# EAGLE design Voltage meter_Rev1 (EAGLE 6.5.0)
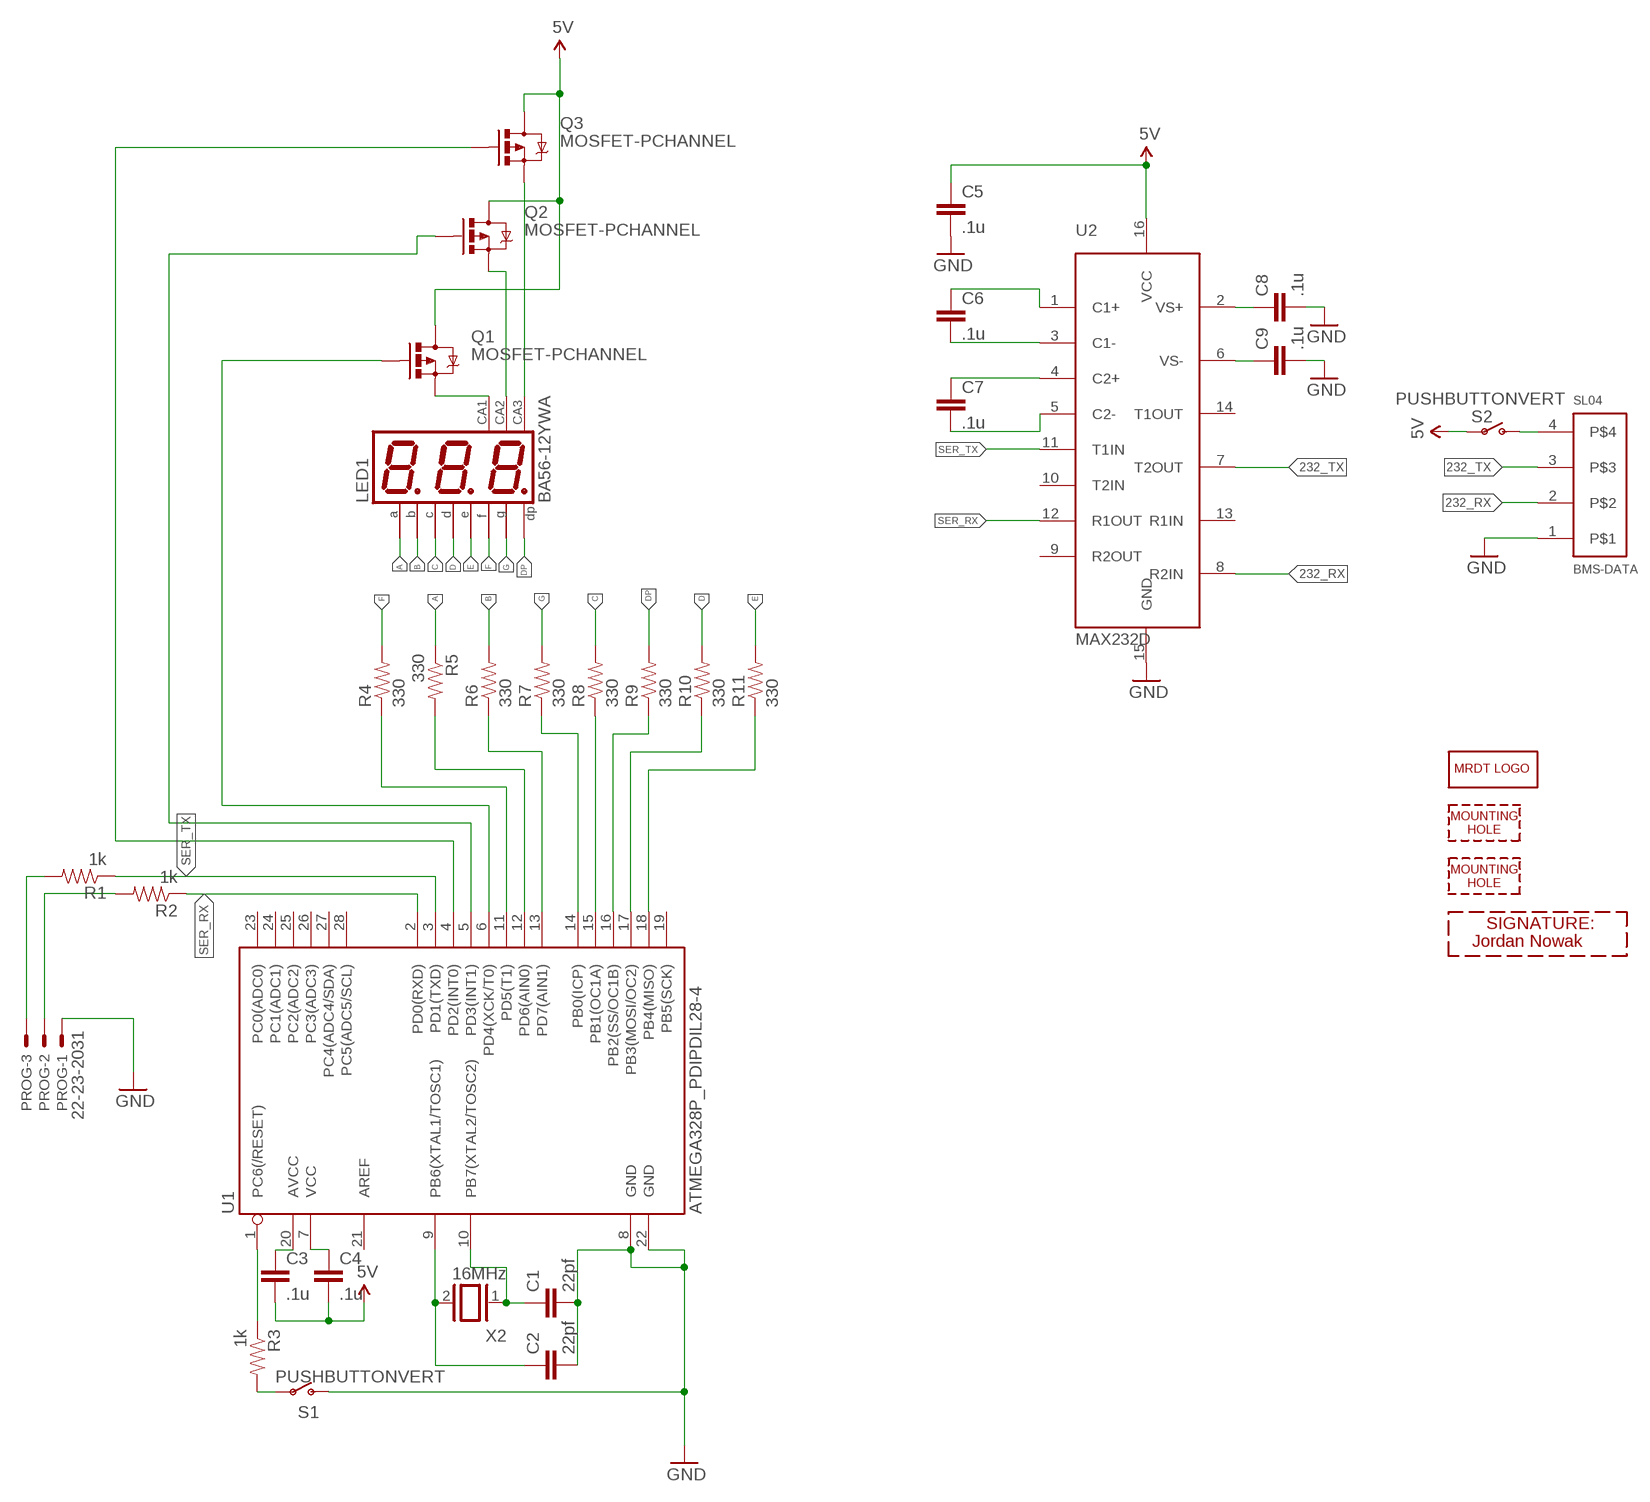
[diagram p0: schematic, sheet 1]

## Parts
BMS-DATA  SL04  [MOLEX_SL_04_TH]
C1  22pf  CAP0805  [0805]
C2  22pf  CAP0805  [0805]
C3  .1u  CAP0805  [0805]
C4  .1u  CAP0805  [0805]
C5  .1u  CAP0805  [0805]
C6  .1u  CAP0805  [0805]
C7  .1u  CAP0805  [0805]
C8  .1u  CAP0805  [0805]
C9  .1u  CAP0805  [0805]
H1  MOUNTING_HOLE#4  [#4_SCREW]
H4  MOUNTING_HOLE#4  [#4_SCREW]
LED1  BA56-12YWA  [BX56-12]
LOGO1  MRDT_LOGO  [MRDT_LOGO]
PROG  22-23-2031  [22-23-2031]
Q1  MOSFET-PCHANNEL  [SOT23-3]
Q2  MOSFET-PCHANNEL  [SOT23-3]
Q3  MOSFET-PCHANNEL  [SOT23-3]
R1  1k  RESISTOR0805-RES  [0805]
R2  1k  RESISTOR0805-RES  [0805]
R3  1k  RESISTOR0805-RES  [0805]
R4  330  RESISTOR0805-RES  [0805]
R5  330  RESISTOR0805-RES  [0805]
R6  330  RESISTOR0805-RES  [0805]
R7  330  RESISTOR0805-RES  [0805]
R8  330  RESISTOR0805-RES  [0805]
R9  330  RESISTOR0805-RES  [0805]
R10  330  RESISTOR0805-RES  [0805]
R11  330  RESISTOR0805-RES  [0805]
S1  PUSHBUTTONVERT  [APEM-MJTP1243]
S2  PUSHBUTTONVERT  [APEM-MJTP1243]
U1  ATMEGA328P_PDIPDIL28-4  [CONN_IC_DIP_SOCKET_28POS]
U2  MAX232D  [SOIC16]
U$1  JORDAN-NOWAK  [JORDAN-NOWAK-SIG]
X2  16MHz  XTAL/S  [QS]

## Nets
5V: C3.2 C4.2 C5.1 Q1.3(D) Q2.3(D) Q3.3(D) S2.P$1(P) U2.16(VCC)
232_RX: BMS-DATA.2 U2.8(R2IN)
232_TX: BMS-DATA.3 U2.7(T2OUT)
A: LED1.11(A) R5.1
B: LED1.7(B) R6.2
C: LED1.4(C) R8.2
D: LED1.2(D) R10.2
DP: LED1.3(DP) R9.2
E: LED1.1(E) R11.2
F: LED1.10(F) R4.2
G: LED1.5(G) R7.2
GND: BMS-DATA.1 C1.2 C2.2 C5.2 C8.2 C9.2 PROG.1 S1.P$2(S) U1.8(GND) U1.22(GND) U2.15(GND)
N$1: R7.1 U1.14(PB0(ICP))
N$2: LED1.12(CA) Q1.2(S)
N$3: LED1.9(CA) Q2.2(S)
N$4: LED1.8(CA) Q3.2(S)
N$5: R8.1 U1.15(PB1(OC1A))
N$6: R9.1 U1.16(PB2(SS/OC1B))
N$7: BMS-DATA.4 S2.P$2(S)
N$8: R5.2 U1.12(PD6(AIN0))
N$9: R10.1 U1.17(PB3(MOSI/OC2))
N$10: R11.1 U1.18(PB4(MISO))
N$11: C8.1 U2.2(VS+)
N$12: PROG.2 R2.2
N$13: R3.2 S1.P$1(P)
N$14: PROG.3 R1.2
N$15: C4.1 U1.7(VCC)
N$16: C3.1 U1.20(AVCC)
N$18: R6.1 U1.13(PD7(AIN1))
N$20: R4.1 U1.11(PD5(T1))
N$24: R3.1 U1.1(PC6(/RESET))
N$40: C6.1 U2.1(C1+)
N$42: C6.2 U2.3(C1-)
N$43: C7.1 U2.4(C2+)
N$44: C7.2 U2.5(C2-)
N$45: C9.1 U2.6(VS-)
N$50: C2.1 U1.9(PB6(XTAL1/TOSC1)) X2.2
N$51: C1.1 U1.10(PB7(XTAL2/TOSC2)) X2.1
Q4: Q3.1(G) U1.4(PD2(INT0))
Q5: Q2.1(G) U1.5(PD3(INT1))
Q6: Q1.1(G) U1.6(PD4(XCK/T0))
SER_RX: R2.1 U1.2(PD0(RXD)) U2.12(R1OUT)
SER_TX: R1.1 U1.3(PD1(TXD)) U2.11(T1IN)
Unconnected: U1.19(PB5(SCK)) U1.21(AREF) U1.23(PC0(ADC0)) U1.24(PC1(ADC1)) U1.25(PC2(ADC2)) U1.26(PC3(ADC3)) U1.27(PC4(ADC4/SDA)) U1.28(PC5(ADC5/SCL)) U2.9(R2OUT) U2.10(T2IN) U2.13(R1IN) U2.14(T1OUT)

## Library data of the parts
BMS-DATA = MRDT-Connectors:SL04
C1-C9 = SparkFun-Passives:CAP: Capacitor Standard 0603 ceramic capacitor, and 0.1" leaded capacitor.
H1 H4 = MRDT-Hardware:MOUNTING_HOLE: Mounting hole for M6 bolt. Standard use mounting hole for: Tiva C Connected - M6 Anderson Powerpole Mounting Wing - M8 Most frame-mounted PCB's - M8
LED1 = display-kingbright:B?56-12*WA: 14.22mm (0.56INCH) THREE DIGIT NUMERIC DISPLAY Source: http://www.kingbright.com .. BA56-11EWA(Ver1189474895.pdf; OC_FARNELL: unknown; OC_NEWARK: unknown
LOGO1 = MRDT-Hardware:MRDT_LOGO
PROG = con-molex:22-23-2031: .100" (2.54mm) Center Header - 3 Pin; MF: MOLEX; MPN: 22-23-2031; OC_FARNELL: 1462950; OC_NEWARK: 30C0862
Q1-Q3 = SparkFun-DiscreteSemi:MOSFET-PCHANNEL: Generic PMOSFET IRLML2244 - TRANS-11153 (SOT-23 -20V -4.3A) (1.Gate 2.Source 3.Drain) FQP27P06 - COM-10349 <http://www.sparkfun.com/products/10349> (TO-220 -60V -27A) (1.Gate 2.Source 3.Drain); PROD_ID: TRANS-08285
R1-R11 = SparkFun-Passives:RESISTOR: Resistor Basic schematic elements and footprints for 0603, 1206, and PTH resistors.
S1 S2 = MRDT-UserInput:PUSHBUTTON; PARTNO: MJTP1243
U1 = SparkFun-DigitalIC:ATMEGA328P_PDIP: uC used in the Arduino 32kb flash, 1k EEPROM, 2k SRAM This is the through-hole version of this chip.
U2 = MRDT-ICs:MAX*232; OPERATING_VOLTAGE: 5V
U$1 = sig:JORDAN-NOWAK
X2 = special:XTAL/S: CRYSTAL

## Board
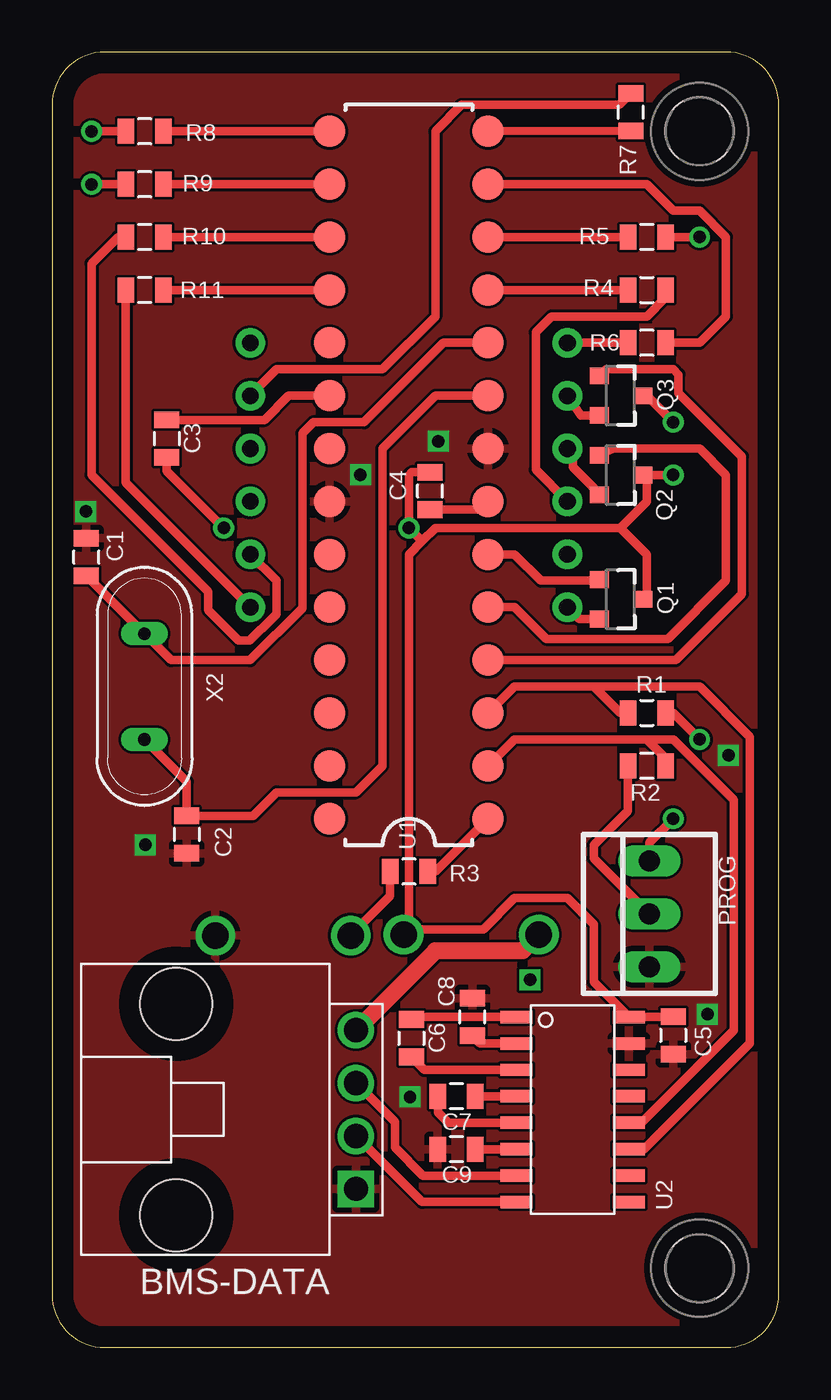
[diagram p1: board, top side]
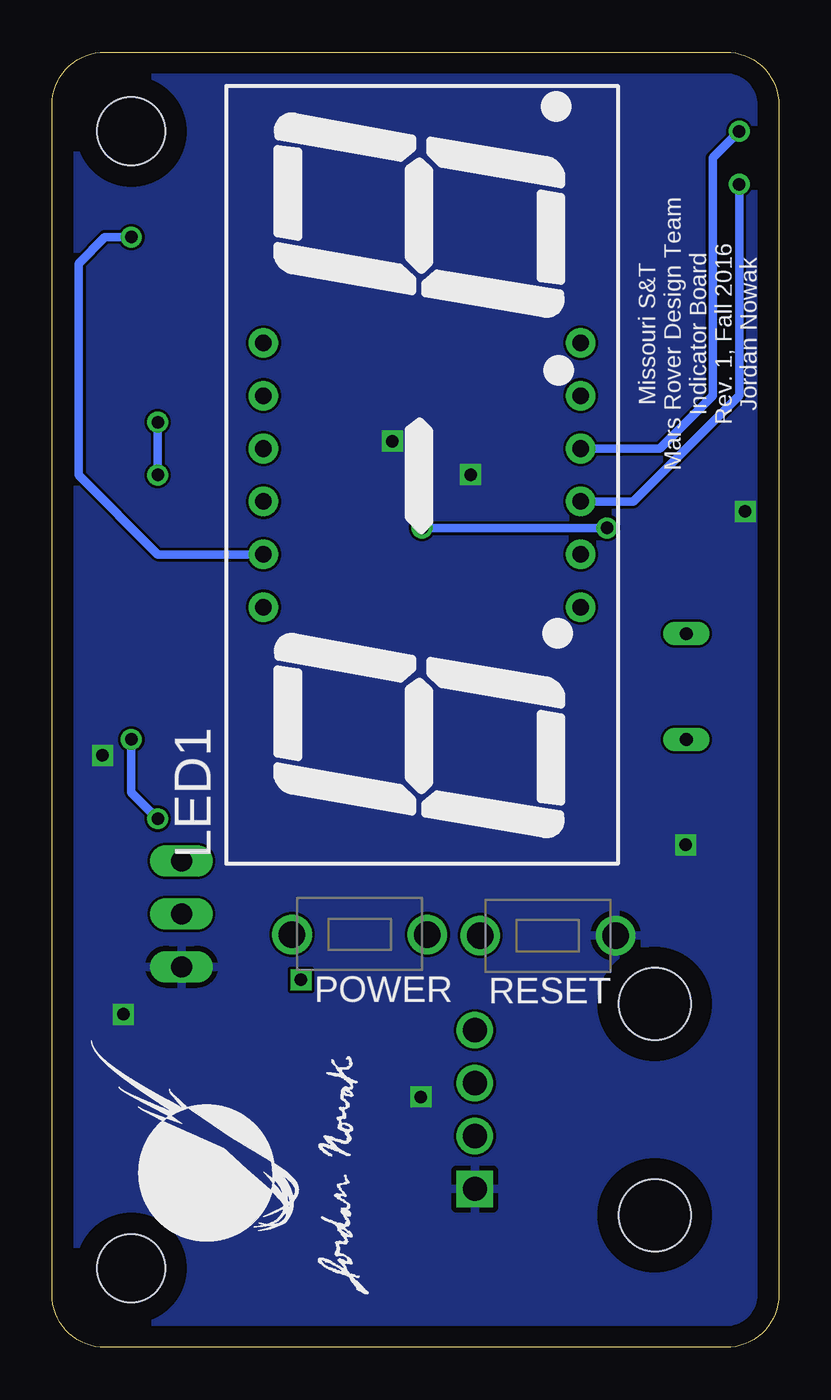
[diagram p2: board, bottom side, seen from below]

Size 34.92 x 62.23 mm. Coordinates in mm from the lower left corner, seen from the top.
Outline: 32.38,62.23 2.54,62.23 arc90 0,59.69 0,2.54 arc90 2.54,0 32.38,0 arc90 34.92,2.54 34.92,59.69 arc90 32.38,62.23
Copper layers (1*16): Top 0.035mm / dielectric 1.5mm / Bottom 0.035mm
Design rules "advanced_circuits_standard": minimum track width 5mil, minimum drill 10mil, track to track 5mil, track to pad 5mil, pad to pad 5mil, via to via 5mil, smd to smd 5mil, copper to edge 40mil, drill to drill 5mil, minimum pad ring 10mil, minimum via ring 8mil, stop-mask expansion 4mil, vias tented up to drill 0mil, thermal gap 10mil

### Footprints (pad centres in the part's own frame; a part is rotated, then mirrored left to right if it is on the bottom)
MOLEX_SL_04_TH = drill 1.168 square: 1 -3.81,0 | drill 1.168: 2 -1.27,0; 3 1.27,0; 4 3.81,0 | hole 3.454: -5.08,8.636; 5.08,8.636
0805 = smd 0.8 x 1.2: 1 -0.9,0; 2 0.9,0
#4_SCREW = hole 3.264: 0,0
BX56-12 = drill 0.8 pad 1.422: 1 -6.35,-7.62; 2 -3.81,-7.62; 3 -1.27,-7.62; 4 1.27,-7.62; 5 3.81,-7.62; 6 6.35,-7.62; 7 6.35,7.62; 8 3.81,7.62; 9 1.27,7.62; 10 -1.27,7.62; 11 -3.81,7.62; 12 -6.35,7.62
22-23-2031 = drill 1 long: 1 -2.54,0; 2 0,0; 3 2.54,0
SOT23-3 = smd 0.8 x 0.9: 1 -0.95,-1; 2 0.95,-1; 3 0,1.1
APEM-MJTP1243 = drill 1.27: P$1 -0.254,1.753; P$2 6.248,1.753
CONN_IC_DIP_SOCKET_28POS = smd 1.524 x 1.524: 1 -17.78,-3.81; 2 -15.24,-3.81; 3 -12.7,-3.81; 4 -10.16,-3.81; 5 -7.62,-3.81; 6 -5.08,-3.81; 7 -2.54,-3.81; 8 0,-3.81; 9 2.54,-3.81; 10 5.08,-3.81; 11 7.62,-3.81; 12 10.16,-3.81; 13 12.7,-3.81; 14 15.24,-3.81; 15 15.24,3.81; 16 12.7,3.81; 17 10.16,3.81; 18 7.62,3.81; 19 5.08,3.81; 20 2.54,3.81; 21 0,3.81; 22 -2.54,3.81; 23 -5.08,3.81; 24 -7.62,3.81; 25 -10.16,3.81; 26 -12.7,3.81; 27 -15.24,3.81; 28 -17.78,3.81
SOIC16 = smd 0.6 x 1.55: 1 -4.445,-2.7; 2 -3.175,-2.7; 3 -1.905,-2.7; 4 -0.635,-2.7; 5 0.635,-2.7; 6 1.905,-2.7; 7 3.175,-2.7; 8 4.445,-2.7; 9 4.445,2.7; 10 3.175,2.7; 11 1.905,2.7; 12 0.635,2.7; 13 -0.635,2.7; 14 -1.905,2.7; 15 -3.175,2.7; 16 -4.445,2.7
QS = drill 0.61 long: 1 -2.54,0; 2 2.54,0

### Placement (x,y rotation side)
BMS-DATA  14.61,11.43 90 top
C1  1.65,37.97 90 top
C2  6.48,24.64 270 top
C3  5.51,43.66 270 top
C4  18.16,41.15 90 top
C5  29.84,14.99 270 top
C6  17.27,14.86 270 top
C7  19.43,12.06 180 top
C8  20.19,15.88 90 top
C9  19.43,9.53 180 top
H1  31.12,58.42 0 top
H4  31.12,3.81 0 top
LED1  17.14,41.91 90 bottom
LOGO1  22.22,5.08 90 bottom
PROG  28.7,20.83 90 top
Q1  27.3,35.94 270 top
Q2  27.3,41.91 270 top
Q3  27.3,45.72 270 top
R1  28.57,30.48 0 top
R2  28.57,27.94 180 top
R3  17.14,22.86 180 top
R4  28.57,50.8 0 top
R5  28.57,53.34 180 top
R6  28.57,48.26 180 top
R7  27.81,59.34 90 top
R8  4.44,58.42 180 top
R9  4.44,55.88 180 top
R10  4.44,53.34 180 top
R11  4.44,50.8 180 top
S1  14.1,18.03 0 bottom
S2  17.14,21.59 180 bottom
U1  17.14,43.18 90 top
U2  25.02,11.43 270 top
U$1  19.68,2.54 90 bottom
X2  4.44,31.75 270 top

### Tracks (layer width: path | path; a pad name or v marks a point on that pad's centre or on a via)
5V  (via drill 0.6)
  Top 0.406: 17.14,20.09 20.73,20.09 22.22,21.59 24.77,21.59 26.04,20.32 26.04,17.56 U2.16 29.83,15.88 C5.1 | 17.14,20.09 17.14,38.1 17.78,38.73 | 17.78,38.73 18.41,39.37 27.3,39.37 | 27.3,39.37 28.57,38.1 28.57,36.11 Q1.3 | 27.3,39.37 28.57,40.64 28.57,41.74 Q2.3 v29.84,41.91 | Q3.3 28.57,45.72 v29.84,44.45 | 17.78,38.73 v17.14,39.37 17.14,41.91 17.28,42.05 C4.2 | v8.26,39.37 5.51,42.11 C3.2 | 17.14,20.09 S2.P$1
  Bottom 0.406: v29.84,44.45 v29.84,41.91 | v17.14,39.37 v8.26,39.37
232_RX
  Top 0.406: U2.8 17.78,6.99 BMS-DATA.2
232_TX
  Top 0.406: U2.7 17.83,8.26 16.47,9.61 16.47,10.83 BMS-DATA.3
A  (via drill 0.6)
  Top 0.406: v31.12,53.34 R5.1
  Bottom 0.406: LED1.11 29.84,38.1 33.66,41.91 33.66,52.07 32.38,53.34 v31.12,53.34
B
  Top 0.406: R6.2 LED1.7
C  (via drill 0.6)
  Top 0.406: v1.91,58.42 R8.2
  Bottom 0.406: LED1.4 5.71,43.18 3.17,45.72 3.17,57.15 v1.91,58.42
D
  Top 0.406: LED1.2 10.79,36.83 10.79,35.24 10.07,34.51 10.04,34.51 9.49,33.96 8.97,33.96 7.51,35.42 7.51,36.31 1.91,41.91 1.91,52.07 3.17,53.34 R10.2
DP  (via drill 0.6)
  Top 0.406: v1.91,55.88 R9.2
  Bottom 0.406: LED1.3 6.99,40.64 1.91,45.72 v1.91,55.88
E
  Top 0.406: R11.2 3.54,41.54 LED1.1
F
  Top 0.406: R4.2 29.47,50.43 28.57,49.53 24,49.53 23.24,48.77 23.24,42.16 LED1.10
G
  Top 0.406: LED1.5 10.79,46.99 15.88,46.99 18.41,49.53 18.41,58.42 19.68,59.69 27.25,59.69 R7.2
GND  (via drill 0.6)
  other vias: 31.5,16 17.2,12.04 1.62,40.16 4.48,24.15 32.5,28.44 18.56,43.54 14.82,41.92
  pour Bottom: -3.17,66.04 46.35,67.31 47.62,-1.27 -3.17,-1.27
  pour Top: -1.91,64.77 46.35,64.77 45.09,0 -0.64,-3.81
N$1
  Top 0.406: R7.1 U1.14
N$2
  Top 0.406: 25.03,35.29 LED1.12 25.33,34.99 Q1.2
N$3
  Top 0.406: Q2.2 26.05,41.26 25.02,42.29 25.02,42.93 LED1.9
N$4
  Top 0.406: Q3.2 25.41,44.77 LED1.8
N$5
  Top 0.406: R8.1 U1.15
N$6
  Top 0.406: R9.1 U1.16
N$7
  Top 0.813: S2.P$2 22.61,19.05 18.41,19.05 BMS-DATA.4
N$8
  Top 0.406: R5.2 U1.12
N$9
  Top 0.406: R10.1 U1.17
N$10
  Top 0.406: R11.1 U1.18
N$11
  Top 0.406: U2.2 20.56,14.61 C8.1
N$12
  Top 0.406: R2.2 27.67,25.77 26.04,24.13 26.04,23.5 PROG.2
N$13
  Top 0.406: R3.2 16.24,21.68 S1.P$1
N$14  (via drill 0.6)
  Top 0.406: PROG.3 28.7,24.26 v29.84,25.4 | v31.12,29.21 29.84,30.48 R1.2
  Bottom 0.406: v29.84,25.4 31.12,26.67 v31.12,29.21
N$15
  Top 0.406: C4.1 20.56,40.25 U1.7
N$16
  Top 0.406: C3.1 10.22,44.56 11.37,45.72 U1.20
N$18
  Top 0.406: R6.1 31.12,48.26 32.38,49.53 32.38,53.34 31.12,54.61 29.84,54.61 28.57,55.88 U1.13
N$20
  Top 0.406: R4.1 U1.11
N$21  (via drill 0.6)
  other vias: 22.97,17.66
N$24
  Top 0.406: R3.1 18.41,22.86 U1.1
N$40
  Top 0.406: U2.1 17.39,15.88 C6.1
N$42
  Top 0.406: U2.3 17.9,13.34 C6.2
N$43
  Top 0.406: U2.4 C7.1
N$44
  Top 0.406: U2.5 19.05,10.79 18.54,11.3 C7.2
N$45
  Top 0.406: U2.6 C9.1
N$50
  Top 0.406: U1.9 18.41,45.72 15.88,43.18 15.88,27.94 14.61,26.67 10.79,26.67 9.66,25.54 C2.1 6.48,27.18 X2.2
N$51
  Top 0.406: C1.1 X2.1 5.71,33.02 9.53,33.02 12.03,35.52 12.03,43.92 12.56,44.45 15,44.45 18.81,48.26 U1.10
Q4
  Top 0.406: U1.4 29.97,33.02 33.15,36.2 33.15,42.8 30.1,45.85 30.1,46.74 29.84,46.99 26.62,46.99 Q3.1
Q5
  Top 0.406: U1.5 22.22,35.56 23.75,34.04 29.59,34.04 32.38,36.83 32.38,41.91 31.12,43.18 27,43.18 Q2.1
Q6
  Top 0.406: U1.6 22.22,38.1 23.49,36.83 26.14,36.83 Q1.1
SER_RX
  Top 0.406: U2.12 28.32,10.79 32.77,15.24 32.77,26.29 29.84,29.21 28.57,29.21 | 28.57,29.21 22.22,29.21 U1.2 | R2.1 29.47,28.31 28.57,29.21
SER_TX
  Top 0.406: U2.11 28.45,9.53 33.53,14.61 33.53,29.34 31.12,31.75 26.04,31.75 | 26.04,31.75 22.22,31.75 U1.3 | R1.1 27.3,30.48 26.04,31.75

### Text on the board
bPlace: Missouri S&T / Mars Rover Design Team / Indicator Board / Rev. 1, Fall 2016 / Jordan Nowak | RESET | POWER